# Altium schematic sheet TS3USBCA410_USB_C_SBU_Multiplexer.SchDoc: BQ24392 SPST USB Switch
size A4
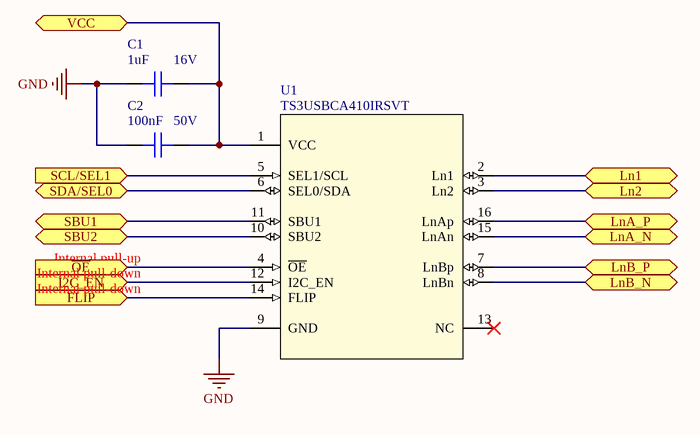
[diagram p0: TS3USBCA410_USB_C_SBU_Multiplexer.SchDoc]

## Parts
C1  Capacitance: 1uF  Voltage Rating: 16V  [C0402]  (hidden comment: CAP CER 1UF 16V X5R 0402)
C2  Capacitance: 100nF  Voltage: 50V  [C0402]  (hidden comment: CAP CER 0.1UF 50V X7R 0402)
U1  TS3USBCA410IRSVT  [RSV16_TEX]

## Ports
FLIP (in), I2C_EN (in), Ln1 (bidir), Ln2 (bidir), LnA_N (bidir), LnA_P (bidir), LnB_N (bidir), LnB_P (bidir), SBU1 (bidir), SBU2 (bidir), SCL/SEL1 (in), SDA/SEL0 (bidir), VCC, ~{OE} (in)

## Nets
GND: C1.2 C2.2 U1.9(GND)
~{OE}: U1.4(~{OE}) ; port ~{OE}
FLIP: U1.14(FLIP) ; port FLIP
I2C_EN: U1.12(I2C_EN) ; port I2C_EN
Ln1: U1.2(Ln1) ; port Ln1
Ln2: U1.3(Ln2) ; port Ln2
LnA_N: U1.15(LnAn) ; port LnA_N
LnA_P: U1.16(LnAp) ; port LnA_P
LnB_N: U1.8(LnBn) ; port LnB_N
LnB_P: U1.7(LnBp) ; port LnB_P
SBU1: U1.11(SBU1) ; port SBU1
SBU2: U1.10(SBU2) ; port SBU2
SCL/SEL1: U1.5(SEL1/SCL) ; port SCL/SEL1
SDA/SEL0: U1.6(SEL0/SDA) ; port SDA/SEL0
VCC: C1.1 C2.1 U1.1(VCC) ; port VCC

Not connected (* = marked no-connect by the designer): U1 13(NC)*

## Notes on the sheet
- (near U1) Internal pull-up
- (near U1) Internal pull-down
- Title
- Size:
- Date:
- A4
- Number:
- Time:
- Revision:
- Sheet
- of
- File:

## Library data of the parts
C1 = CAP CER 1UF 16V X5R 0402: 1µF ±10% 16V Ceramic Capacitor X5R 0402 (1005 Metric); Manufacturer: Yageo; Manufacturer Part Number: CC0402KRX5R7BB105; Supplier 1: Digi-Key; Stock 1: 1114963; Pricing 1: 1=0.4, 10=0.278, 100=0.167, 500=0.1253, 1000=0.1058, 2500=0.1002, 5000=0.0947 (USD); Mount: Surface Mount; Case/Package: 0402; Case Code (Metric): 1005; Case Code (Imperial): 0402; Min Operating Temperature: -55°C; Max Operating Temperature: 85°C; Packaging: Tape and Reel; Tolerance: 10%; Voltage Rating (DC): 16V; Dielectric: X5R; Length: 1mm; Width: 0.02inch; Thickness: 0.022inch; Lead Free: Lead Free; Halogen Free: Halogen Free; ComponentLink1URL: http://www.yageo.com/documents/recent/UPY-GPHC_X5R_4V-to-50V_12.pdf?src-supplier=Avnet+Europe; ComponentLink1Description: http://www.yageo.com/documents/recent/UPY-GPHC_X5R_4V-to-50V_12.pdf?src-supplier=Avnet+Europe; Supplier Part Number 1: 311-1691-1-ND; Weight: 2.3E-05oz; Termination: SMD/SMT; Composition: Ceramic; Height: 0.5mm; Depth: 0.5mm; Radiation Hardening: No
C2 = CAP CER 0.1UF 50V X7R 0402: 0.1µF ±10% 50V Ceramic Capacitor X7R 0402 (1005 Metric); Manufacturer: TDK; Manufacturer Part Number: CGA2B3X7R1H104K050BB; Supplier 1: Digi-Key; Stock 1: 2925303; Pricing 1: 1=0.17, 10=0.118, 50=0.0668, 100=0.0553, 500=0.0388, 1000=0.0321, 2500=0.0299, 5000=0.0273 (USD); Mount: Surface Mount; Case/Package: 0402; Weight: 2.3E-05oz; Case Code (Metric): 1005; Case Code (Imperial): 0402; Min Operating Temperature: -55°C; Max Operating Temperature: 125°C; Voltage Rating: 50V; Tolerance: 10%; Packaging: Tape and Reel; Package Quantity: 1; Voltage Rating (DC): 50V; Dielectric: X7R; Termination: SMD/SMT; Composition: Ceramic; Length: 1mm; Height: 0.5mm; Width: 0.02inch; Thickness: 0.022inch; Depth: 0.5mm; Ratings: AEC-Q200; REACH SVHC: No SVHC; Lead Free: Lead Free; ComponentLink1URL: http://product.tdk.com/capacitor/mlcc/en/documents/mlccspec_automotive_general_midvoltage_en.pdf?src-supplier=Future+Electronics; ComponentLink1Description: http://product.tdk.com/capacitor/mlcc/en/documents/mlccspec_automotive_general_midvoltage_en.pdf?src-supplier=Future+Electronics; ComponentLink2URL: http://www.farnell.com/datasheets/1807242.pdf?src-supplier=Element14; ComponentLink2Description: http://www.farnell.com/datasheets/1807242.pdf?src-supplier=Element14; ComponentLink3URL: http://www.mouser.com/ds/2/400/lcc_automotive_general_en-843974.pdf?src-supplier=Mouser; ComponentLink3Description: http://www.mouser.com/ds/2/400/lcc_automotive_general_en-843974.pdf?src-supplier=Mouser; ComponentLink4URL: http://www.farnell.com/datasheets/1936565.pdf?src-supplier=Element14; ComponentLink4Description: http://www.farnell.com/datasheets/1936565.pdf?src-supplier=Element14; ComponentLink5URL: http://www.farnell.com/datasheets/1735392.pdf?src-supplier=Element14; ComponentLink5Description: http://www.farnell.com/datasheets/1735392.pdf?src-supplier=Element14; Supplier Part Number 1: 445-6899-1-ND
U1 = IC TS3USBCA410IRSVT SBU MUX 3TO1 W/ MIC AND GNDIND T: USB Switch IC 1 Channel 16-UQFN (2.6x1.8); Manufacturer: Texas Instruments; Number of Channels: 3; Supplier 1: Digi-Key; Manufacturer Part Number: TS3USBCA410IRSVT; Stock 1: 250; Pricing 1: 1=1.07, 10=0.959, 25=0.91, 100=0.6988 (USD); ComponentLink1URL: https://www.ti.com/lit/gpn/ts3usbca4; ComponentLink1Description: Datasheet; Supplier Part Number 1: 296-52158-1-ND; Min Operating Temperature: -40°C; Max Operating Temperature: 85°C; Mount: Surface Mount